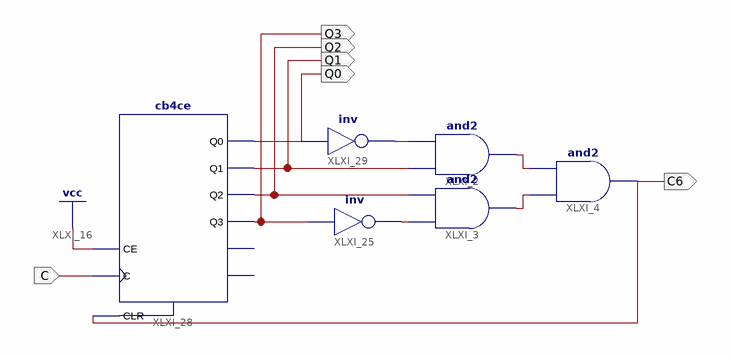
[diagram p0: schematic sheet 1]
// Xilinx ISE schematic contador6.sch (spartan3e) as structural Verilog: 6 symbols, 6 ports
module contador6 (
  input  C,
  output C6,
  output Q1,
  output Q2,
  output Q3,
  output Q0
);

  wire XLXN_3, XLXN_4, XLXN_43, XLXN_46;

  and XLXI_4 (C6, XLXN_4, XLXN_3);
  and XLXI_2 (XLXN_3, Q1, XLXN_46);
  and XLXI_3 (XLXN_4, XLXN_43, Q2);
  not XLXI_25 (XLXN_43, Q3);
  cb4ce XLXI_28 (.C(C), .CE(1'b1), .CLR(C6), .Q0(Q0), .Q1(Q1), .Q2(Q2), .Q3(Q3));  // open: CEO, TC
  not XLXI_29 (XLXN_46, Q0);
endmodule
